# Altium schematic sheet Top.SchDoc
size A4
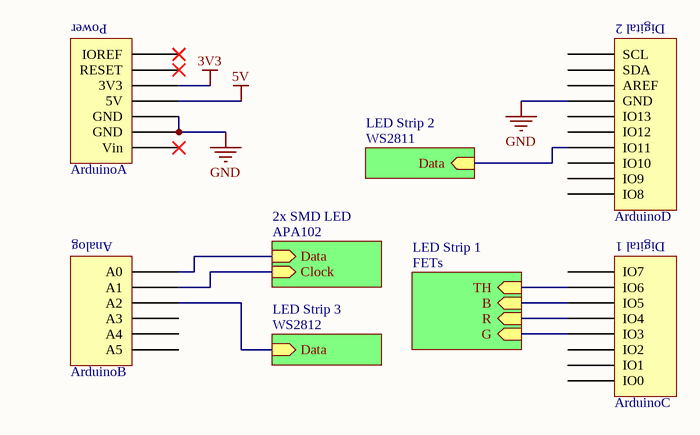
[diagram p0: Top.SchDoc]

## Parts
Arduino  Uno  [Arduino Uno]  (value not drawn)  (parts A,B,C,D of 5)

## Sub-sheets
2x SMD LED = APA102: Data (in), Clock (in)
LED Strip 1 = FETs: B (in), G (in), R (in), TH (in)
LED Strip 2 = WS2811: Data (in)
LED Strip 3 = WS2812: Data (in)

## Nets
3V3: Arduino.3V3
5V: Arduino.5V
GND: Arduino.GND1(GND) Arduino.GND2(GND) Arduino.GND3(GND)
NetArduino_3: Arduino.3(IO3) ; sheet LED Strip 1/G
NetArduino_4: Arduino.4(IO4) ; sheet LED Strip 1/R
NetArduino_5: Arduino.5(IO5) ; sheet LED Strip 1/B
NetArduino_6: Arduino.6(IO6) ; sheet LED Strip 1/TH
NetArduino_11: Arduino.11(IO11) ; sheet LED Strip 2/Data
NetArduino_A0: Arduino.A0 ; sheet 2x SMD LED/Data
NetArduino_A1: Arduino.A1 ; sheet 2x SMD LED/Clock
NetArduino_A2: Arduino.A2 ; sheet LED Strip 3/Data

Not connected (* = marked no-connect by the designer): Arduino 0(IO0) 1(IO1) 2(IO2) 7(IO7) 8(IO8) 9(IO9) 10(IO10) 12(IO12) 13(IO13) A3 A4 A5 AREF IOREF* RESET* SCL SDA Vin*

## Notes on the sheet
- (in symbol Arduino Uno, part A) Power
- (in symbol Arduino Uno, part B) Analog
- (in symbol Arduino Uno, part C) Digital 1
- (in symbol Arduino Uno, part D) Digital 2

## Library data of the parts
Arduino = Arduino Uno